# Altium schematic sheet ModuleConnectorC.SchDoc
size A portrait; SheetNumber: 3; SheetTotal: 24
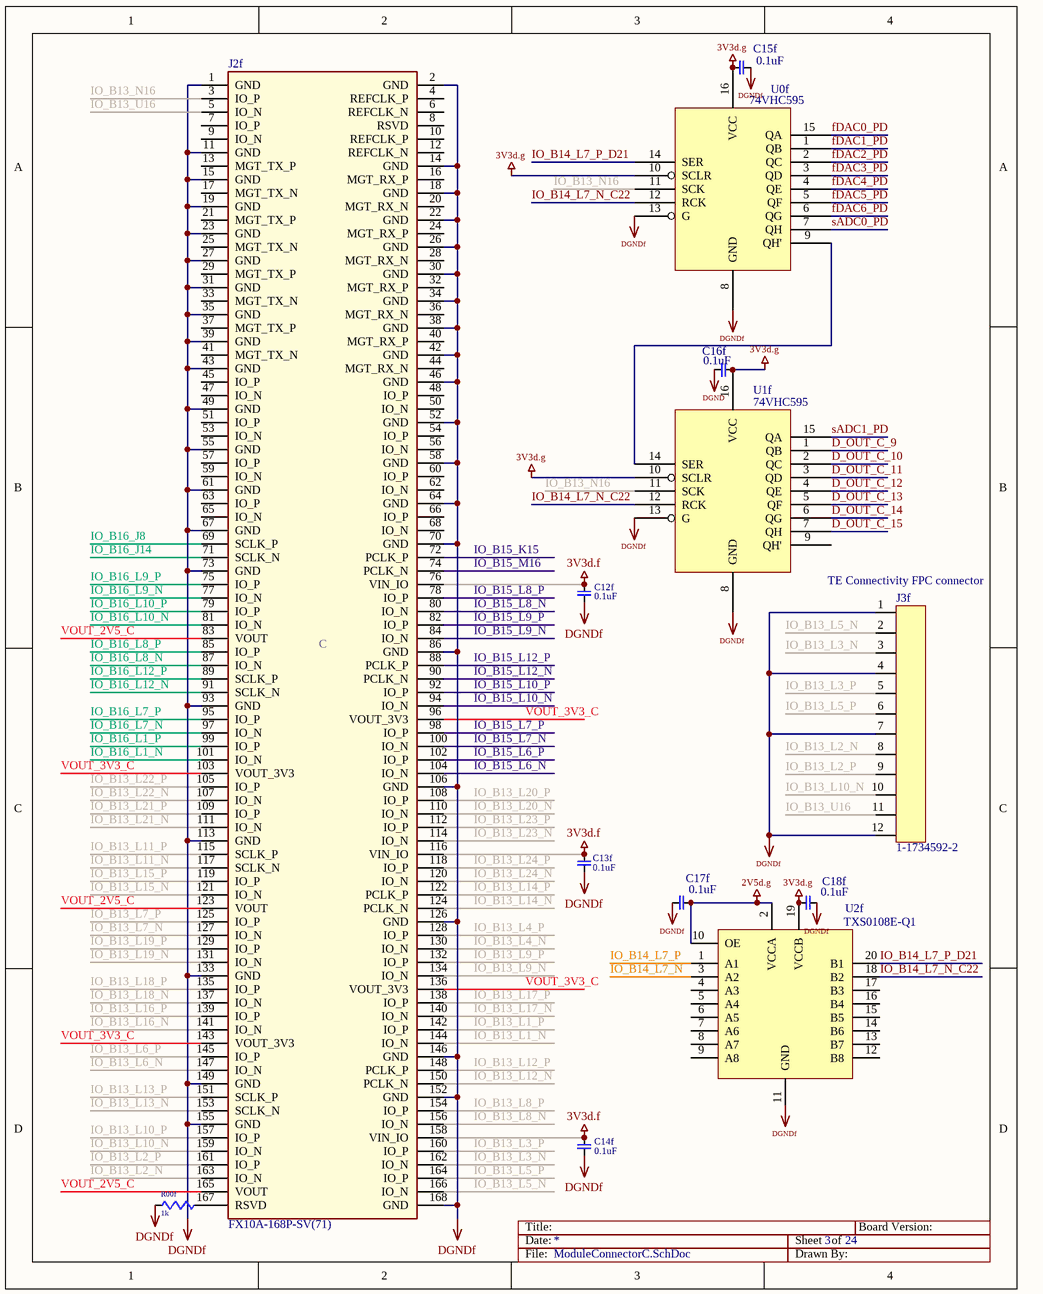
[diagram p0: ModuleConnectorC.SchDoc]

## Parts
C12f  0.1uF  [0603]
C13f  0.1uF  [0603]
C14f  0.1uF  [0603]
C15f  0.1uF  [0603]
C16f  0.1uF  [0603]
C17f  0.1uF  [0603]
C18f  0.1uF  [0603]
J2f  FX10A-168P-SV(71)  [Mercury_Baseboard_Connector]
J3f  1-1734592-2  [FPC12]
R00f  1k  [0603]
U0f  74VHC595  [16TSSOP]
U1f  74VHC595  [16TSSOP]
U2f  TXS0108E-Q1  [R-PDSO-G20]

## Nets
2V5d.g: C17f.1 U2f.2(VCCA) U2f.10(OE)
3V3d.f: C12f.1 C13f.1 C14f.1 J2f.76(VIN_IO) J2f.116(VIN_IO) J2f.158(VIN_IO)
3V3d.g: C15f.2 C16f.1 C18f.2 U0f.10(SCLR) U0f.16(VCC) U1f.10(SCLR) U1f.16(VCC) U2f.19(VCCB)
DGND: C16f.2
DGNDf: C12f.2 C13f.2 C14f.2 C15f.1 C17f.2 C18f.1 J2f.1(GND) J2f.2(GND) J2f.11(GND) J2f.14(GND) J2f.15(GND) J2f.18(GND) J2f.19(GND) J2f.22(GND) J2f.23(GND) J2f.26(GND) J2f.27(GND) J2f.30(GND) J2f.31(GND) J2f.34(GND) J2f.35(GND) J2f.38(GND) J2f.39(GND) J2f.42(GND) J2f.43(GND) J2f.46(GND) J2f.49(GND) J2f.52(GND) J2f.55(GND) J2f.58(GND) J2f.61(GND) J2f.64(GND) J2f.67(GND) J2f.70(GND) J2f.73(GND) J2f.86(GND) J2f.93(GND) J2f.106(GND) J2f.113(GND) J2f.126(GND) J2f.133(GND) J2f.146(GND) J2f.149(GND) J2f.152(GND) J2f.155(GND) J2f.168(GND) J3f.1 J3f.4 J3f.7 J3f.12 R00f.2 U0f.8(GND) U0f.13(G) U1f.8(GND) U1f.13(G) U2f.11(GND)
D_OUT_C_9: U1f.1(QB)
D_OUT_C_10: U1f.2(QC)
D_OUT_C_11: U1f.3(QD)
D_OUT_C_12: U1f.4(QE)
D_OUT_C_13: U1f.5(QF)
D_OUT_C_14: U1f.6(QG)
D_OUT_C_15: U1f.7(QH)
fDAC0_PD: U0f.15(QA)
fDAC1_PD: U0f.1(QB)
fDAC2_PD: U0f.2(QC)
fDAC3_PD: U0f.3(QD)
fDAC4_PD: U0f.4(QE)
fDAC5_PD: U0f.5(QF)
fDAC6_PD: U0f.6(QG)
IO_B13_L1_N: J2f.144(IO_N)
IO_B13_L1_P: J2f.142(IO_P)
IO_B13_L2_N: J2f.163(IO_N) J3f.8
IO_B13_L2_P: J2f.161(IO_P) J3f.9
IO_B13_L3_N: J2f.162(IO_N) J3f.3
IO_B13_L3_P: J2f.160(IO_P) J3f.5
IO_B13_L4_N: J2f.130(IO_N)
IO_B13_L4_P: J2f.128(IO_P)
IO_B13_L5_N: J2f.166(IO_N) J3f.2
IO_B13_L5_P: J2f.164(IO_P) J3f.6
IO_B13_L6_N: J2f.147(IO_N)
IO_B13_L6_P: J2f.145(IO_P)
IO_B13_L7_N: J2f.127(IO_N)
IO_B13_L7_P: J2f.125(IO_P)
IO_B13_L8_N: J2f.156(IO_N)
IO_B13_L8_P: J2f.154(IO_P)
IO_B13_L9_N: J2f.134(IO_N)
IO_B13_L9_P: J2f.132(IO_P)
IO_B13_L10_N: J2f.159(IO_N) J3f.10
IO_B13_L10_P: J2f.157(IO_P)
IO_B13_L11_N: J2f.117(SCLK_N)
IO_B13_L11_P: J2f.115(SCLK_P)
IO_B13_L12_N: J2f.150(PCLK_N)
IO_B13_L12_P: J2f.148(PCLK_P)
IO_B13_L13_N: J2f.153(SCLK_N)
IO_B13_L13_P: J2f.151(SCLK_P)
IO_B13_L14_N: J2f.124(PCLK_N)
IO_B13_L14_P: J2f.122(PCLK_P)
IO_B13_L15_N: J2f.121(IO_N)
IO_B13_L15_P: J2f.119(IO_P)
IO_B13_L16_N: J2f.141(IO_N)
IO_B13_L16_P: J2f.139(IO_P)
IO_B13_L17_N: J2f.140(IO_N)
IO_B13_L17_P: J2f.138(IO_P)
IO_B13_L18_N: J2f.137(IO_N)
IO_B13_L18_P: J2f.135(IO_P)
IO_B13_L19_N: J2f.131(IO_N)
IO_B13_L19_P: J2f.129(IO_P)
IO_B13_L20_N: J2f.110(IO_N)
IO_B13_L20_P: J2f.108(IO_P)
IO_B13_L21_N: J2f.111(IO_N)
IO_B13_L21_P: J2f.109(IO_P)
IO_B13_L22_N: J2f.107(IO_N)
IO_B13_L22_P: J2f.105(IO_P)
IO_B13_L23_N: J2f.114(IO_N)
IO_B13_L23_P: J2f.112(IO_P)
IO_B13_L24_N: J2f.120(IO_N)
IO_B13_L24_P: J2f.118(IO_P)
IO_B13_N16: J2f.3(IO_P) U0f.11(SCK) U1f.11(SCK)
IO_B13_U16: J2f.5(IO_N) J3f.11
IO_B14_L7_N: U2f.3(A2)
IO_B14_L7_N_C22: U0f.12(RCK) U1f.12(RCK) U2f.18(B2)
IO_B14_L7_P: U2f.1(A1)
IO_B14_L7_P_D21: U0f.14(SER) U2f.20(B1)
IO_B15_K15: J2f.72(PCLK_P)
IO_B15_L6_N: J2f.104(IO_N)
IO_B15_L6_P: J2f.102(IO_P)
IO_B15_L7_N: J2f.100(IO_N)
IO_B15_L7_P: J2f.98(IO_P)
IO_B15_L8_N: J2f.80(IO_N)
IO_B15_L8_P: J2f.78(IO_P)
IO_B15_L9_N: J2f.84(IO_N)
IO_B15_L9_P: J2f.82(IO_P)
IO_B15_L10_N: J2f.94(IO_N)
IO_B15_L10_P: J2f.92(IO_P)
IO_B15_L12_N: J2f.90(PCLK_N)
IO_B15_L12_P: J2f.88(PCLK_P)
IO_B15_M16: J2f.74(PCLK_N)
IO_B16_J8: J2f.69(SCLK_P)
IO_B16_J14: J2f.71(SCLK_N)
IO_B16_L1_N: J2f.101(IO_N)
IO_B16_L1_P: J2f.99(IO_P)
IO_B16_L7_N: J2f.97(IO_N)
IO_B16_L7_P: J2f.95(IO_P)
IO_B16_L8_N: J2f.87(IO_N)
IO_B16_L8_P: J2f.85(IO_P)
IO_B16_L9_N: J2f.77(IO_N)
IO_B16_L9_P: J2f.75(IO_P)
IO_B16_L10_N: J2f.81(IO_N)
IO_B16_L10_P: J2f.79(IO_P)
IO_B16_L12_N: J2f.91(SCLK_N)
IO_B16_L12_P: J2f.89(SCLK_P)
sADC0_PD: U0f.7(QH)
sADC1_PD: U1f.15(QA)
VOUT_2V5_C: J2f.83(VOUT) J2f.123(VOUT) J2f.165(VOUT)
VOUT_3V3_C: J2f.96(VOUT_3V3) J2f.103(VOUT_3V3) J2f.136(VOUT_3V3) J2f.143(VOUT_3V3)
NetJ2f_167: J2f.167(RSVD) R00f.1
NetU0f_9: U0f.9(QH') U1f.14(SER)

Not connected (* = marked no-connect by the designer): J2f 4(REFCLK_P) 6(REFCLK_N) 7(IO_P) 8(RSVD) 9(IO_N) 10(REFCLK_P) 12(REFCLK_N) 13(MGT_TX_P) 16(MGT_RX_P) 17(MGT_TX_N) 20(MGT_RX_N) 21(MGT_TX_P) 24(MGT_RX_P) 25(MGT_TX_N) 28(MGT_RX_N) 29(MGT_TX_P) 32(MGT_RX_P) 33(MGT_TX_N) 36(MGT_RX_N) 37(MGT_TX_P) 40(MGT_RX_P) 41(MGT_TX_N) 44(MGT_RX_N) 45(IO_P) 47(IO_N) 48(IO_P) 50(IO_N) 51(IO_P) 53(IO_N) 54(IO_P) 56(IO_N) 57(IO_P) 59(IO_N) 60(IO_P) 62(IO_N) 63(IO_P) 65(IO_N) 66(IO_P) 68(IO_N); U1f 9(QH'); U2f 4(A3) 5(A4) 6(A5) 7(A6) 8(A7) 9(A8) 12(B8) 13(B7) 14(B6) 15(B5) 16(B4) 17(B3)

## Notes on the sheet
- TE Connectivity FPC connector
- Title:
- Date:
- Sheet
- of
- Board Version:
- File:
- Drawn By:
- (in symbol Mercury_Baseboard_Connector-C) C

## Library data of the parts
C12f C13f C14f C15f C16f C17f C18f = CAP
J2f = Mercury_Baseboard_Connector-C: Mercury Baseboard Connector; Manufacturer: Hirose; DistPartNumber: FX10A-168P-SV(71)-ND; Board_Variant: ALL; Check Sch: CG_2015-03-03; Enclustra PN: EN100374; Geometry.Height: 4mm stack height; Distributor: Digikey; Package: SMD - 168pin Hirose; ROHS: Yes; Characteristics: -; Supplier: Enclustra; Check PCB: -; Cost: 4.50; ManufPartNumber: FX10A-168P-SV(71); Temperature: -55..+85°C; Type: Connector; Value: FX10A-168P-SV(71)
J3f = FPC12
R00f = RES
U2f = 8BitLevelShifter